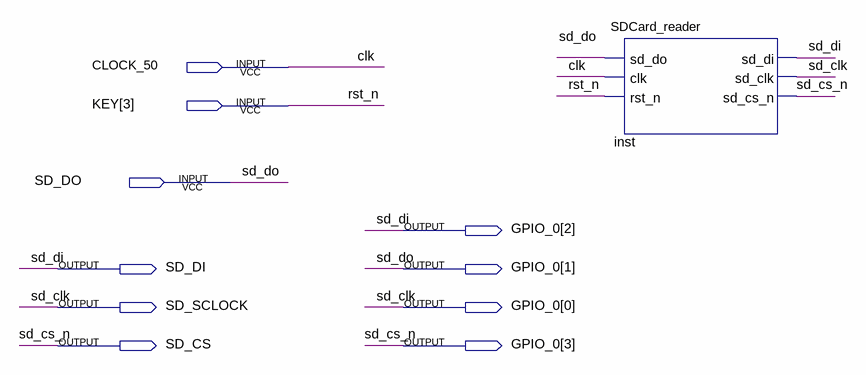
[diagram p0: schematic sheet]
// Quartus schematic SoundPlayer.bdf as structural Verilog: 1 symbols, 10 pins
module SoundPlayer (
  input  CLOCK_50,
  input  [3:3] KEY,
  input  SD_DO,
  output [3:0] GPIO_0,
  output SD_DI,
  output SD_SCLOCK,
  output SD_CS
);

  SDCard_reader inst (
    .sd_do(SD_DO), .clk(CLOCK_50), .rst_n(KEY[3]), .sd_di(GPIO_0[2]), .sd_clk(GPIO_0[0]), .sd_cs_n(GPIO_0[3]));

  assign GPIO_0[1] = SD_DO;
  assign SD_CS = GPIO_0[3];
  assign SD_DI = GPIO_0[2];
  assign SD_SCLOCK = GPIO_0[0];

  // Other names for the same wires on the sheet: clk = CLOCK_50; rst_n = KEY[3]; sd_clk = GPIO_0[0];
  //   sd_cs_n = GPIO_0[3]
endmodule
